# EAGLE schematic ChargerCircuit (EAGLE 9.7.0)
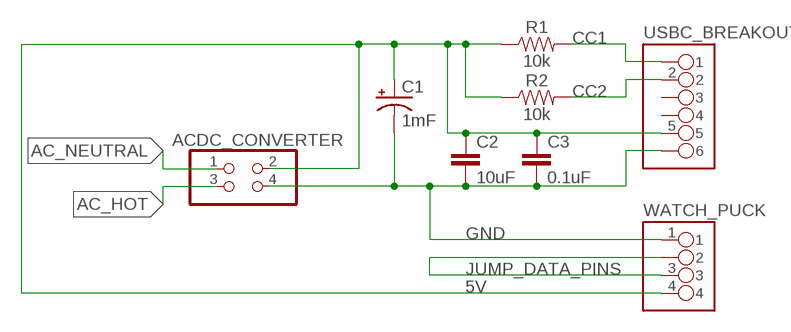
[diagram p0: schematic, sheet 1]

## Parts
ACDC_CONVERTER  PINHD-2X2  [2X02]
C1  1mF  1000UF-RADIAL-5MM-25V-20%  [CPOL-RADIAL-5MM-10MM]
C2  10uF  10UF-0603-6.3V-20%  [0603]
C3  0.1uF  0.1UF-KIT-EZ-50V-20%  [CAP-PTH-SMALL-KIT]
R1  10k  10KOHM-HORIZ-1/4W-1%  [AXIAL-0.3]
R2  10k  10KOHM-HORIZ-1/4W-1%  [AXIAL-0.3]
USBC_BREAKOUT  PINHD-1X06_1X06M  [1X06]
WATCH_PUCK  PINHD-1X04_1X04M  [1X04]

## Nets
5V: ACDC_CONVERTER.2 C1.+ C2.1 C3.1 R1.P$1 R2.P$1 USBC_BREAKOUT.5 WATCH_PUCK.4
AC_HOT: ACDC_CONVERTER.3
AC_NEUTRAL: ACDC_CONVERTER.1
CC1: R1.P$2 USBC_BREAKOUT.1
CC2: R2.P$2 USBC_BREAKOUT.2
GND: ACDC_CONVERTER.4 C1.- C2.2 C3.2 USBC_BREAKOUT.6 WATCH_PUCK.1
JUMP_DATA_PINS: WATCH_PUCK.2 WATCH_PUCK.3
Unconnected: USBC_BREAKOUT.3 USBC_BREAKOUT.4

## Library data of the parts
ACDC_CONVERTER = Connector:PINHD-2X2: PIN HEADER; CATEGORY: Headers; DESCRIPTION: Header-Straight-2x2 Position; PACKAGE_TYPE: THT; PITCH: 0.100" (2.54mm); SUBCATEGORY: Headers-Male Pins; TYPE: Board to Board or Cable-Unshrouded-Through Hole-Straight
C1 = SparkFun-Capacitors:1000UF: 1,000µF/1mF ceramic capacitors A capacitor is a passive two-terminal electrical component used to store electrical energy temporarily in an electric field. CAP-08070; PROD_ID: CAP-09538
C2 = SparkFun-Capacitors:10UF: 10.0µF ceramic capacitors A capacitor is a passive two-terminal electrical component used to store electrical energy temporarily in an electric field.; PROD_ID: CAP-11015
C3 = SparkFun-RF:0.1UF: 0.1µF ceramic capacitors A capacitor is a passive two-terminal electrical component used to store electrical energy temporarily in an electric field.; PROD_ID: CAP-08370
R1 R2 = SparkFun-Resistors:10KOHM: 10kΩ resistor A resistor is a passive two-terminal electrical component that implements electrical resistance as a circuit element. Resistors act to reduce current flow, and, at the same time, act to lower voltage levels within circuits. - Wikipedia; PROD_ID: RES-12183
USBC_BREAKOUT = Tinkercad:PINHD-1X06
WATCH_PUCK = Tinkercad:PINHD-1X04